# EAGLE design Automated_Blinds_Remote (EAGLE 7.6.0)
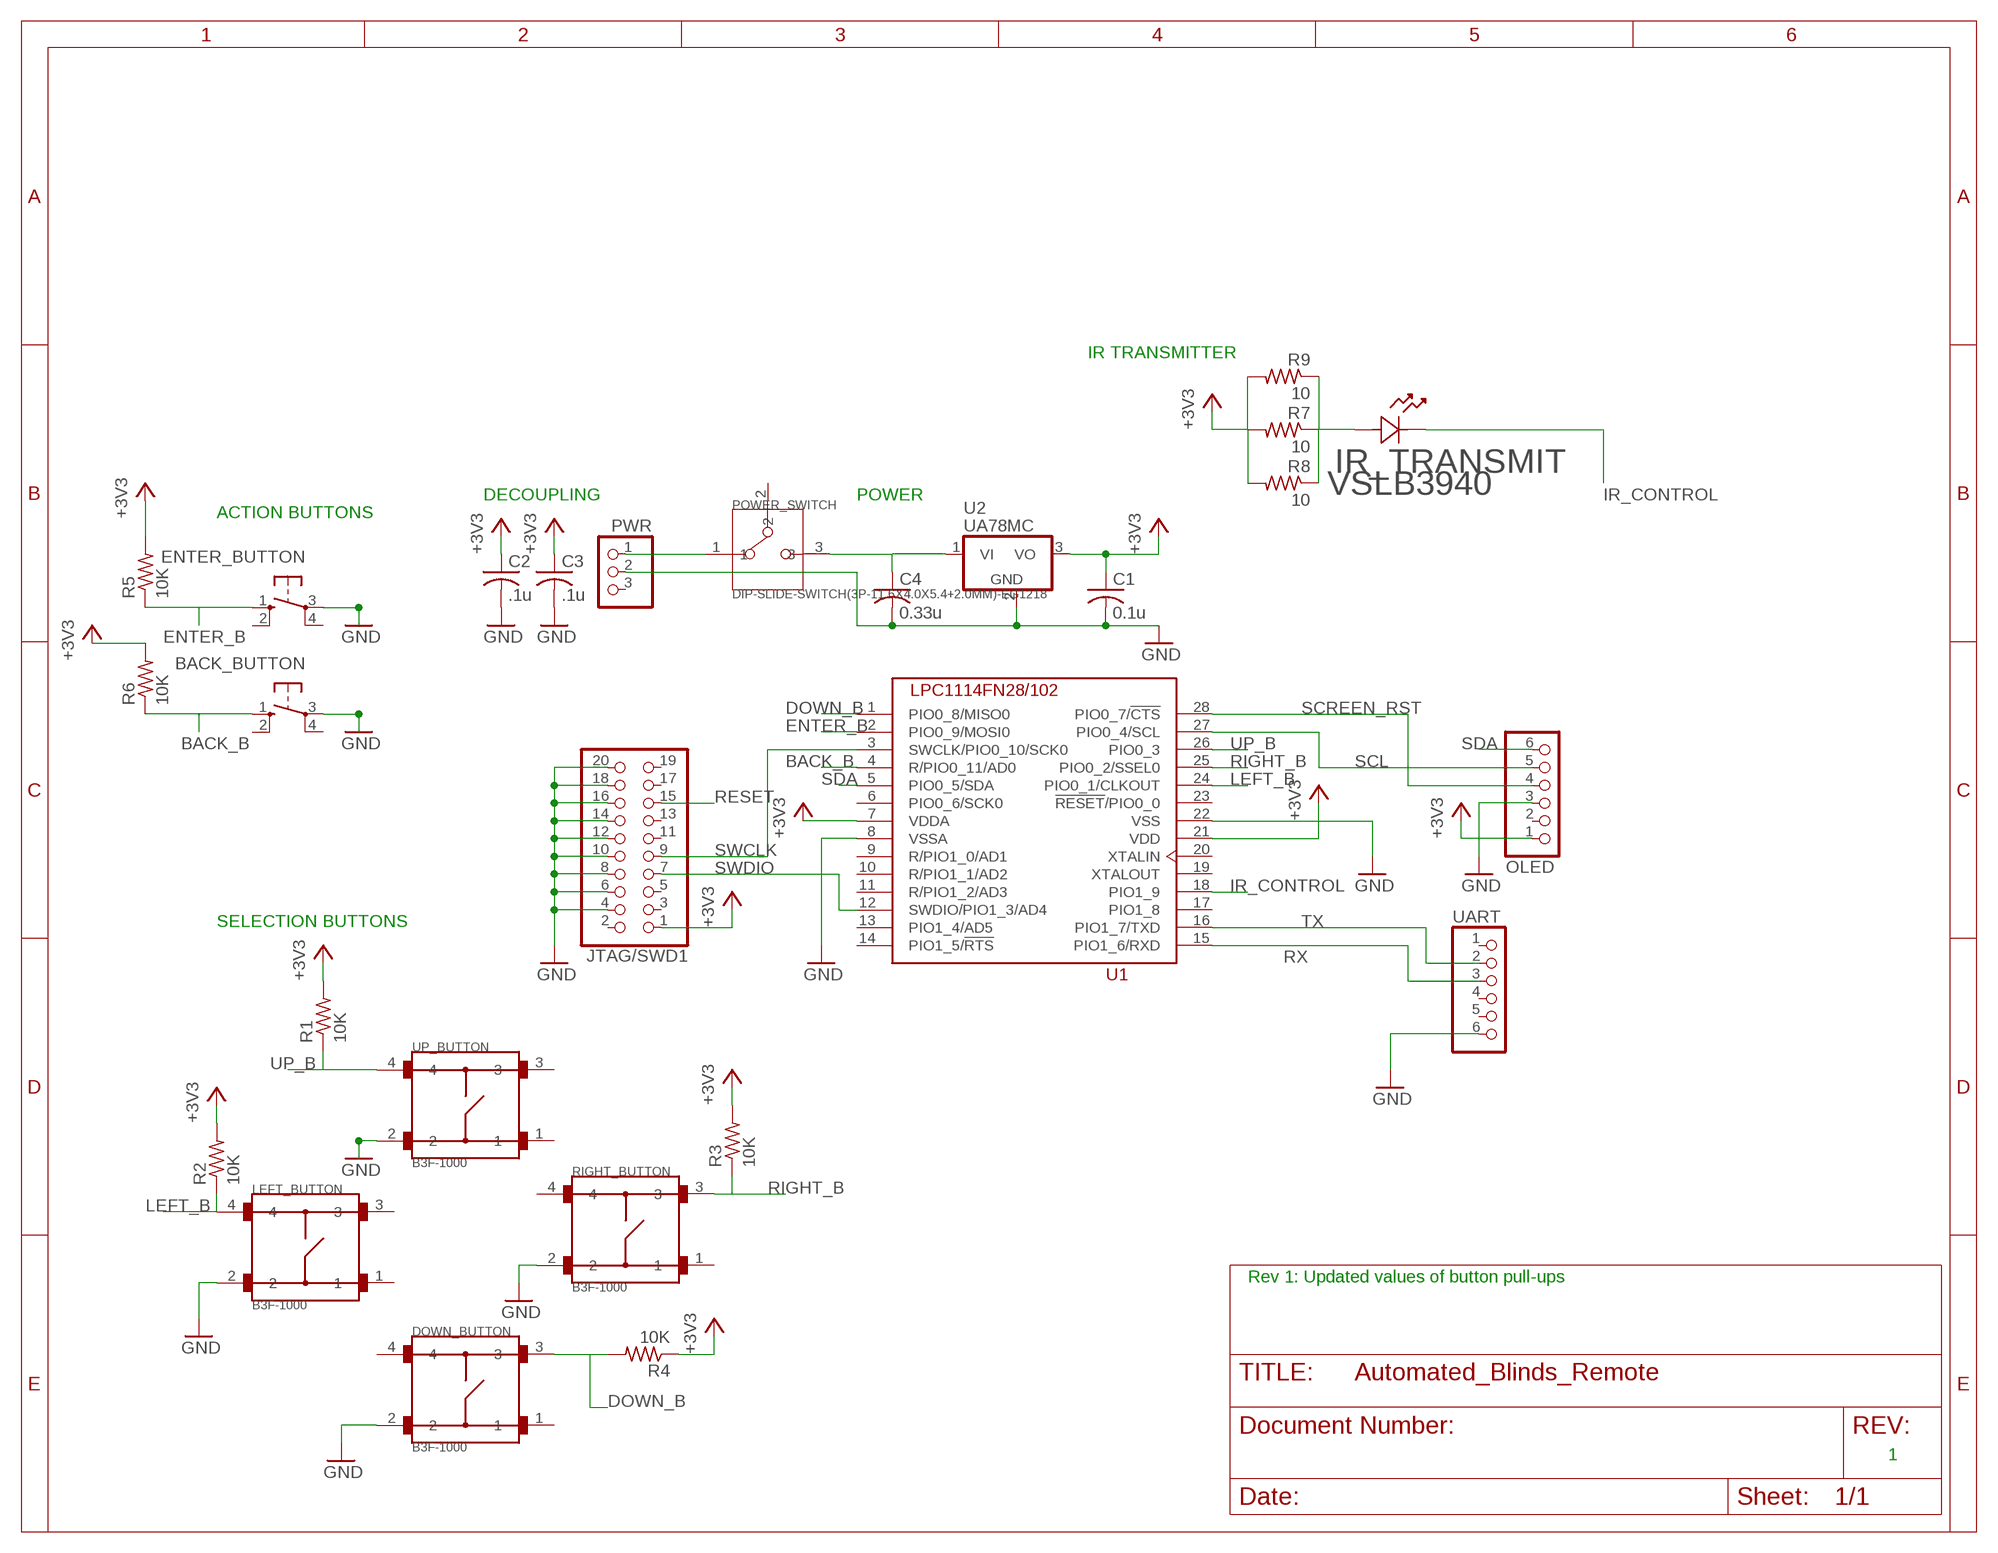
[diagram p0: schematic, sheet 1]

## Parts
BACK_BUTTON  40/XX  [B3F/40XX]
C1  0.1u  C-US050-024X044  [C050-024X044]
C2  .1u  C-US050-024X044  [C050-024X044]
C3  .1u  C-US050-024X044  [C050-024X044]
C4  0.33u  C-US050-024X044  [C050-024X044]
DOWN_BUTTON  B3F-1000  [SW_B3F-1000]
ENTER_BUTTON  40/XX  [B3F/40XX]
IR_TRANSMIT  VSLB3940  [LED_TLH]
JTAG/SWD1  PINHD-2X10  [2X10]
LEFT_BUTTON  B3F-1000  [SW_B3F-1000]
OLED  PINHD-1X6  [1X06]
POWER_SWITCH  DIP-SLIDE-SWITCH(3P-11.6X4.0X5.4+2.0MM)-EG1218  [SW3-2.5-11.6X4.0X5.4+2.0MM]
PWR  PINHD-1X3  [1X03]
R1  10K  R-US_0207/10  [0207/10]
R2  10K  R-US_0207/10  [0207/10]
R3  10K  R-US_0207/10  [0207/10]
R4  10K  R-US_0207/10  [0207/10]
R5  10K  R-US_0207/10  [0207/10]
R6  10K  R-US_0207/10  [0207/10]
R7  10  R-US_0207/10  [0207/10]
R8  10  R-US_0207/10  [0207/10]
R9  10  R-US_0207/10  [0207/10]
RIGHT_BUTTON  B3F-1000  [SW_B3F-1000]
U1  LPC1114FN28/102  [DIL28-6]
U2  UA78MC  [TO220V]
UART  PINHD-1X6  [1X06]
UP_BUTTON  B3F-1000  [SW_B3F-1000]

## Nets
+3V3: C1.1 C2.1 C3.1 JTAG/SWD1.1 OLED.1 R1.2 R2.2 R3.2 R4.1 R5.2 R6.2 R7.2 R8.2 R9.2 U1.7(VDDA) U1.21(VDD) U2.3(VO)
BACK_B: BACK_BUTTON.1(S) R6.1 U1.4(R/PIO0_11/AD0)
DOWN_B: DOWN_BUTTON.3 R4.2 U1.1(PIO0_8/MISO0)
ENTER_B: ENTER_BUTTON.1(S) R5.1 U1.2(PIO0_9/MOSI0)
GND: BACK_BUTTON.3(P) C1.2 C2.2 C3.2 C4.2 DOWN_BUTTON.2 ENTER_BUTTON.3(P) JTAG/SWD1.4 JTAG/SWD1.6 JTAG/SWD1.8 JTAG/SWD1.10 JTAG/SWD1.12 JTAG/SWD1.14 JTAG/SWD1.16 JTAG/SWD1.18 JTAG/SWD1.20 LEFT_BUTTON.2 OLED.3 PWR.2 RIGHT_BUTTON.2 U1.8(VSSA) U1.22(VSS) U2.2(GND) UART.6 UP_BUTTON.2
IR_CONTROL: IR_TRANSMIT.1 U1.18(PIO1_9)
LEFT_B: LEFT_BUTTON.4 R2.1 U1.24(PIO0_1/CLKOUT)
N$1: IR_TRANSMIT.2 R7.1 R8.1 R9.1
N$3: POWER_SWITCH.1 PWR.1
N$4: C4.1 POWER_SWITCH.3 U2.1(VI)
RESET: JTAG/SWD1.15
RIGHT_B: R3.1 RIGHT_BUTTON.3 U1.25(PIO0_2/SSEL0)
RX: U1.15(PIO1_6/RXD) UART.3
SCL: OLED.5 U1.27(PIO0_4/SCL)
SCREEN_RST: OLED.4 U1.28(PIO0_7/!CTS)
SDA: OLED.6 U1.5(PIO0_5/SDA)
SWCLK: JTAG/SWD1.9 U1.3(SWCLK/PIO0_10/SCK0)
SWDIO: JTAG/SWD1.7 U1.12(SWDIO/PIO1_3/AD4)
TX: U1.16(PIO1_7/TXD) UART.2
UP_B: R1.1 U1.26(PIO0_3) UP_BUTTON.4
Unconnected: BACK_BUTTON.2(S1) BACK_BUTTON.4(P1) DOWN_BUTTON.1 DOWN_BUTTON.4 ENTER_BUTTON.2(S1) ENTER_BUTTON.4(P1) JTAG/SWD1.2 JTAG/SWD1.3 JTAG/SWD1.5 JTAG/SWD1.11 JTAG/SWD1.13 JTAG/SWD1.17 JTAG/SWD1.19 LEFT_BUTTON.1 LEFT_BUTTON.3 OLED.2 POWER_SWITCH.2 PWR.3 RIGHT_BUTTON.1 RIGHT_BUTTON.4 U1.6(PIO0_6/SCK0) U1.9(R/PIO1_0/AD1) U1.10(R/PIO1_1/AD2) U1.11(R/PIO1_2/AD3) U1.13(PIO1_4/AD5) U1.14(PIO1_5/!RTS) U1.17(PIO1_8) U1.19(XTALOUT) U1.20(XTALIN) U1.23(!RESET!/PIO0_0) UART.1 UART.4 UART.5 UP_BUTTON.1 UP_BUTTON.3

## Notes on the sheet
- IR TRANSMITTER
- DECOUPLING | POWER
- ACTION BUTTONS
- SELECTION BUTTONS
- Rev 1: Updated values of button pull-ups
- 1

## Library data of the parts
BACK_BUTTON ENTER_BUTTON = switch-omron:40/XX: OMRON SWITCH; OC_FARNELL: unknown; OC_NEWARK: unknown
C1-C4 = rcl:C-US: CAPACITOR, American symbol
DOWN_BUTTON LEFT_BUTTON RIGHT_BUTTON UP_BUTTON = B3F-1000:B3F-1000: Switch, FLUX TIGHT MECHANICAL KEYSwitch, , 50MA@24VDC, NO GROUND TERM., FLAT PLUNG; AVAILABILITY: Good; DESCRIPTION: Switch, FLUX TIGHT MECHANICAL KEYSwitch, , 50MA@24VDC, NO GROUND TERM., FLAT PLUNG; MF: Omron; MP: B3F-1000; PACKAGE: None; PRICE: 0.21 USD
IR_TRANSMIT = VSLB3940:VSLB3940; MANUFACTURER_PART_NUMBER: VSLB3940; VENDOR: Vishay
JTAG/SWD1 = pinhead:PINHD-2X10: PIN HEADER
OLED UART = pinhead:PINHD-1X6: PIN HEADER
POWER_SWITCH = DIP-SLIDE-SWITCH_3P-11.6X4.0X5.4_2.0MM_:DIP-SLIDE-SWITCH(3P-11.6X4.0X5.4+2.0MM): 311010006; AVAILABILITY: Good; DESCRIPTION: EG Series SPDT On-On Vertical Through Hole Slide Switch; MF: E-Switch; MP: EG1218; PACKAGE: FakePackage u; PRICE: 0.41 USD
PWR = pinhead:PINHD-1X3: PIN HEADER
R1-R9 = rcl:R-US_: RESISTOR, American symbol
U1 = lpc_11xx:LPC1114FN28/102
U2 = lpc_11xx:UA78M*C

## Board
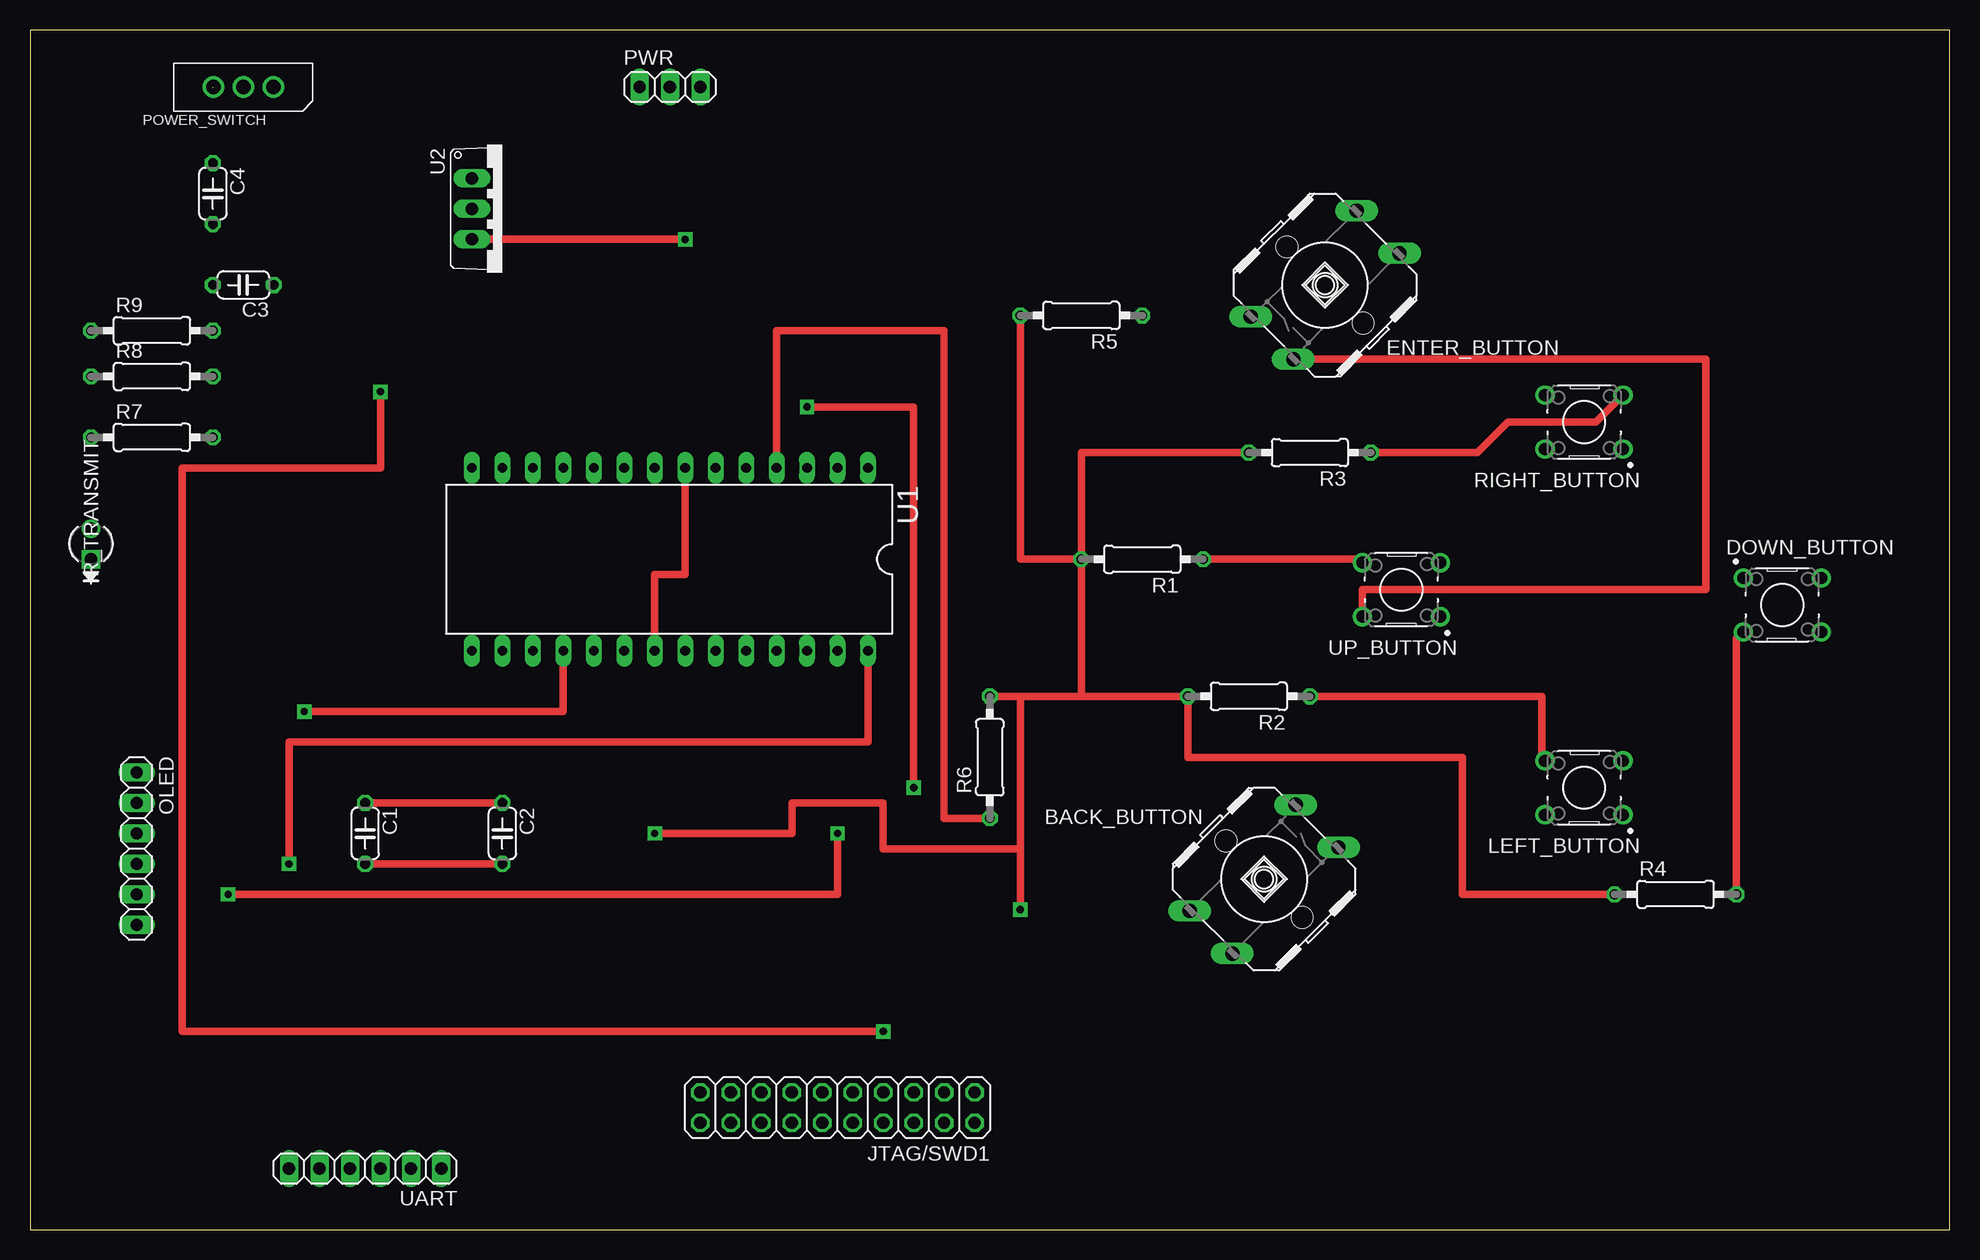
[diagram p1: board, top side]
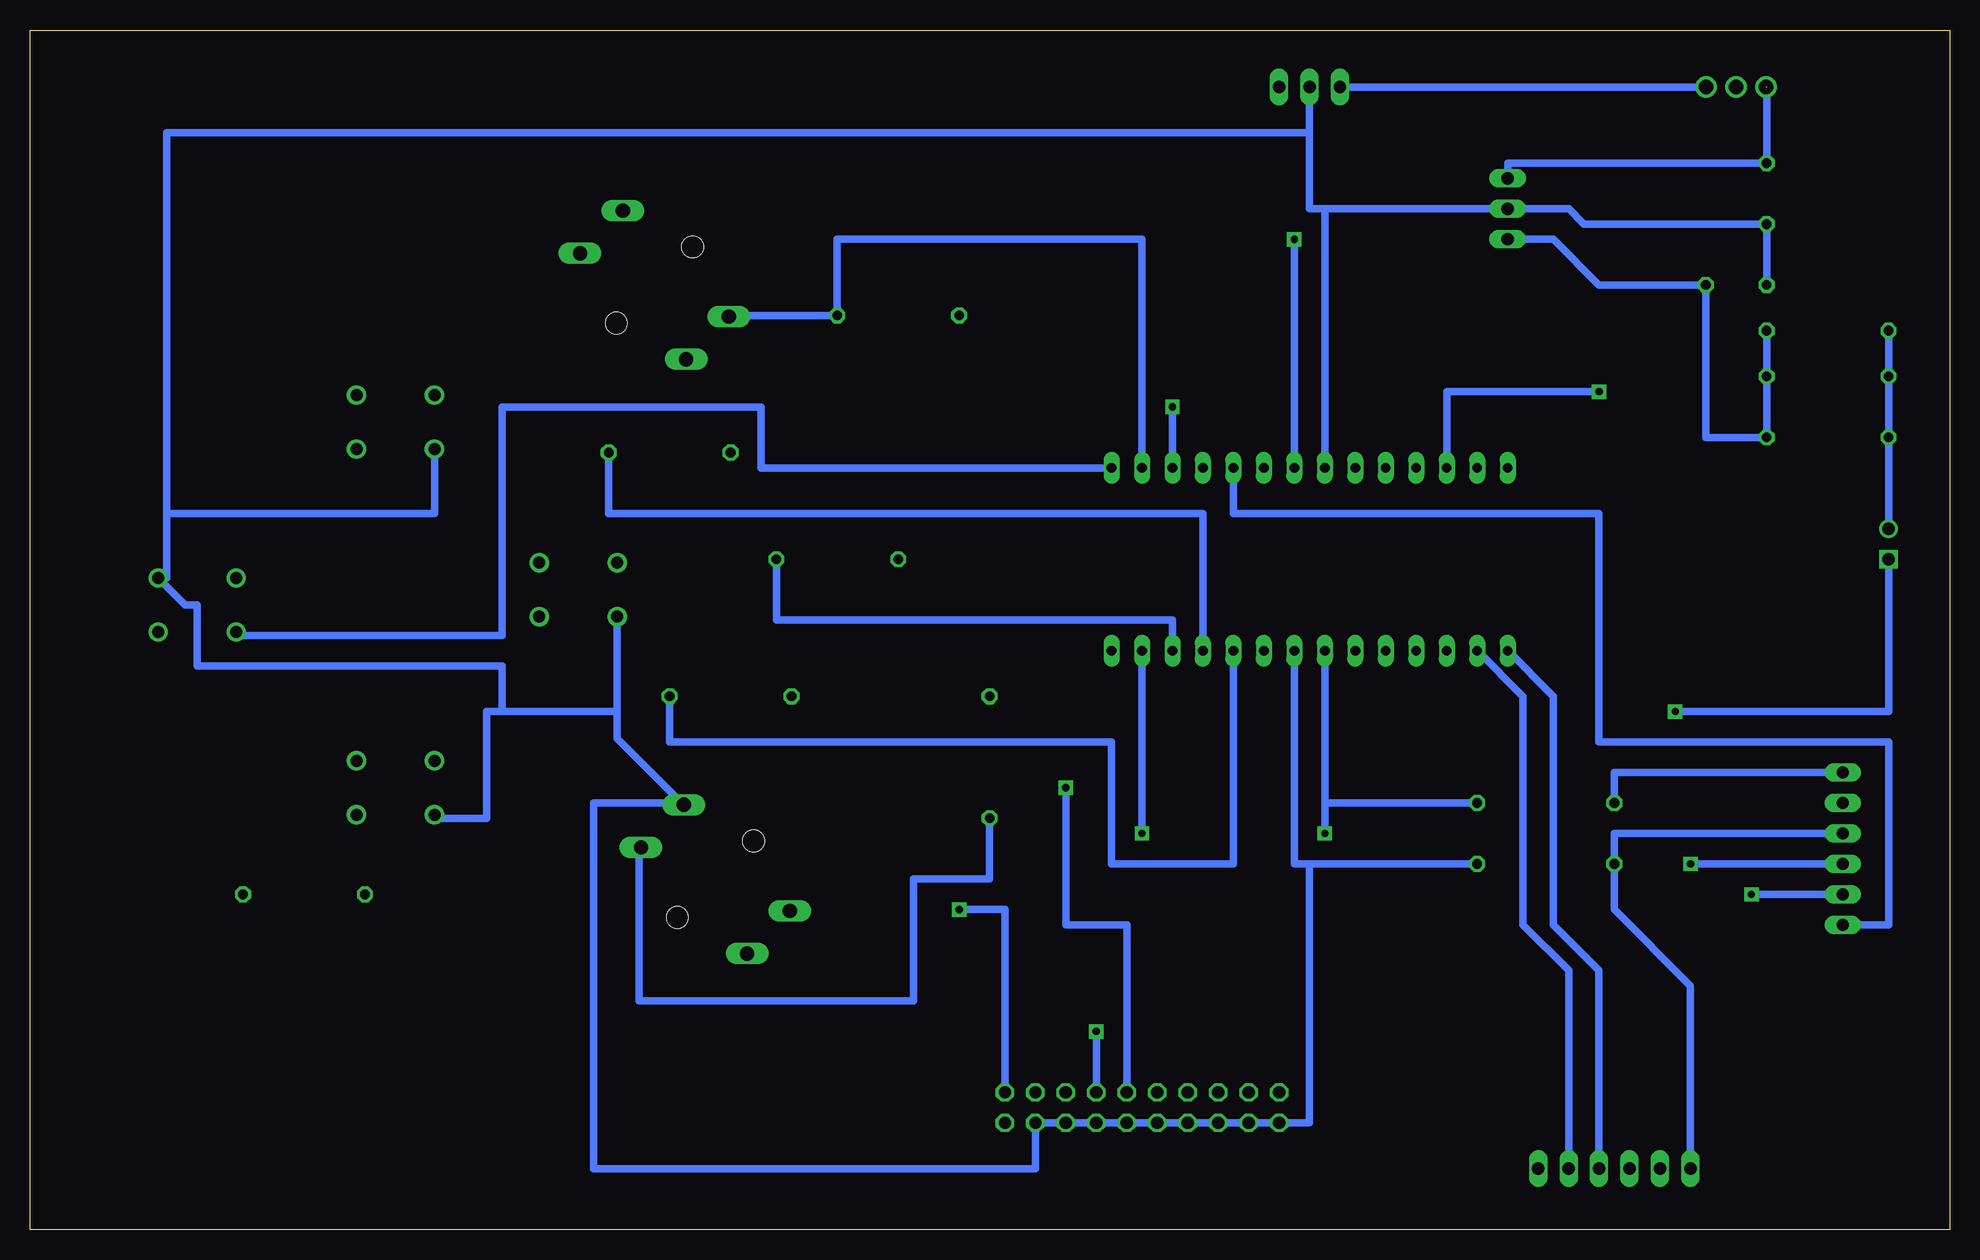
[diagram p2: board, bottom side, seen from below]

Size 160 x 100 mm. Coordinates in mm from the lower left corner, seen from the top.
Outline: 0,0 160,0 160,100 0,100 0,0
Copper layers (1*16): Top 0.035mm / dielectric 1.5mm / Bottom 0.035mm
Design rules "MWSEagleDesignRules3": minimum track width 13mil, minimum drill 22mil, track to track 8.5mil, track to pad 8.5mil, pad to pad 8.5mil, via to via 8.5mil, smd to smd 8mil, copper to edge 40mil, drill to drill 8mil, minimum pad ring 10mil, minimum via ring 8mil, stop-mask expansion 4mil, vias tented up to drill 0mil, thermal gap 10mil

### Footprints (pad centres in the part's own frame; a part is rotated, then mirrored left to right if it is on the bottom)
B3F/40XX = drill 1.194 long: 1 -6.198,-2.642; 2 2.642,6.198; 3 -2.642,-6.198; 4 6.198,2.642 | hole 1.803: -3.175,3.175; 3.175,-3.175
C050-024X044 = drill 0.813 octagon: 1 -2.54,0; 2 2.54,0
SW_B3F-1000 = drill 1 pad 1.6: 1 -3.25,2.25; 2 3.25,2.25; 3 -3.25,-2.25; 4 3.25,-2.25
LED_TLH = drill 1.016 pad 1.524 square: 1 -2.54,0 | drill 1.016 pad 1.524: 2 0,0
2X10 = drill 1.016 octagon: 1 -11.43,-1.27; 2 -11.43,1.27; 3 -8.89,-1.27; 4 -8.89,1.27; 5 -6.35,-1.27; 6 -6.35,1.27; 7 -3.81,-1.27; 8 -3.81,1.27; 9 -1.27,-1.27; 10 -1.27,1.27; 11 1.27,-1.27; 12 1.27,1.27; 13 3.81,-1.27; 14 3.81,1.27; 15 6.35,-1.27; 16 6.35,1.27; 17 8.89,-1.27; 18 8.89,1.27; 19 11.43,-1.27; 20 11.43,1.27
1X06 = drill 1.016 long: 1 -6.35,0; 2 -3.81,0; 3 -1.27,0; 4 1.27,0; 5 3.81,0; 6 6.35,0
SW3-2.5-11.6X4.0X5.4+2.0MM = drill 1.2: 1 -2.5,0; 2 0,0; 3 2.5,0
1X03 = drill 1.016 long: 1 -2.54,0; 2 0,0; 3 2.54,0
0207/10 = drill 0.813 octagon: 1 -5.08,0; 2 5.08,0
DIL28-6 = drill 0.813 long: 1 -16.51,-7.62; 2 -13.97,-7.62; 3 -11.43,-7.62; 4 -8.89,-7.62; 5 -6.35,-7.62; 6 -3.81,-7.62; 7 -1.27,-7.62; 8 1.27,-7.62; 9 3.81,-7.62; 10 6.35,-7.62; 11 8.89,-7.62; 12 11.43,-7.62; 13 13.97,-7.62; 14 16.51,-7.62; 15 16.51,7.62; 16 13.97,7.62; 17 11.43,7.62; 18 8.89,7.62; 19 6.35,7.62; 20 3.81,7.62; 21 1.27,7.62; 22 -1.27,7.62; 23 -3.81,7.62; 24 -6.35,7.62; 25 -8.89,7.62; 26 -11.43,7.62; 27 -13.97,7.62; 28 -16.51,7.62
TO220V = drill 1.016 long: 1 -2.54,-2.54; 2 0,-2.54; 3 2.54,-2.54

### Placement (x,y rotation side)
BACK_BUTTON  102.87,29.21 180 top
C1  27.94,33.02 270 top
C2  39.37,33.02 270 top
C3  17.78,78.74 180 top
C4  15.24,86.36 270 top
DOWN_BUTTON  146.05,52.07 0 top
ENTER_BUTTON  107.95,78.74 0 top
IR_TRANSMIT  5.08,58.42 90 top
JTAG/SWD1  67.31,10.16 180 top
LEFT_BUTTON  129.54,36.83 180 top
OLED  8.89,31.75 270 top
POWER_SWITCH  17.78,95.25 180 top
PWR  53.34,95.25 0 top
R1  92.71,55.88 180 top
R2  101.6,44.45 180 top
R3  106.68,64.77 180 top
R4  137.16,27.94 0 top
R5  87.63,76.2 180 top
R6  80.01,39.37 90 top
R7  10.16,66.04 0 top
R8  10.16,71.12 0 top
R9  10.16,74.93 0 top
RIGHT_BUTTON  129.54,67.31 180 top
U1  53.34,55.88 180 top
U2  39.37,85.09 270 top
UART  27.94,5.08 180 top
UP_BUTTON  114.3,53.34 180 top

### Tracks (layer width: path | path; a pad name or v marks a point on that pad's centre or on a via)
+3V3  (via drill 0.6)
  Top 0.61: C1.1 C2.1 | R6.2 82.55,44.45 | 82.55,44.45 87.63,44.45 | 87.63,44.45 R2.2 96.52,39.37 119.38,39.37 119.38,27.94 R4.1 | R1.2 87.63,44.45 | R5.2 82.55,55.88 R1.2 | U2.3 v54.61,82.55 | R1.2 87.63,64.77 R3.2 | v82.55,26.67 82.55,31.75 | 82.55,31.75 82.55,44.45 | v52.07,33.02 63.5,33.02 63.5,35.56 71.12,35.56 71.12,31.75 82.55,31.75 | U1.21 52.07,54.61 54.61,54.61 U1.7
  Bottom 0.61: OLED.1 27.94,38.1 C1.1 | v54.61,82.55 U1.7 | C2.1 52.07,35.56 | 52.07,35.56 U1.21 | R9.2 R8.2 R7.2 20.32,66.04 C3.1 29.21,78.74 33.02,82.55 U2.3 | JTAG/SWD1.1 78.74,26.67 v82.55,26.67 | 52.07,35.56 v52.07,33.02
BACK_B
  Top 0.61: R6.1 76.2,34.29 76.2,74.93 62.23,74.93 U1.4
  Bottom 0.61: 108.97,31.75 BACK_BUTTON.1 109.22,31.85 109.22,19.05 86.36,19.05 86.36,29.21 80.01,29.21 R6.1
DOWN_B
  Top 0.61: R4.2 142.24,49.26 DOWN_BUTTON.3
  Bottom 0.61: U1.1 99.06,63.5 99.06,68.58 120.65,68.58 120.65,49.53 142.51,49.53 DOWN_BUTTON.3
ENTER_B
  Bottom 0.61: ENTER_BUTTON.1 101.65,76.2 R5.1 92.71,82.55 67.31,82.55 U1.2
GND
  Top 0.61: C1.2 C2.2 | UP_BUTTON.2 111.05,53.34 139.7,53.34 139.7,72.54 ENTER_BUTTON.3
  Bottom 0.61: RIGHT_BUTTON.2 126.29,59.69 148.59,59.69 | 148.59,59.69 148.59,54.32 DOWN_BUTTON.2 147.05,52.07 146.05,52.07 146.05,46.99 120.65,46.99 120.65,43.18 | 52.07,85.09 U2.2 31.75,85.09 30.48,83.82 C4.2 C3.2 | 52.07,85.09 53.34,85.09 53.34,91.44 | 53.34,91.44 PWR.2 | U1.8 52.07,85.09 | C2.2 53.34,30.48 | 53.34,30.48 54.61,30.48 U1.22 | OLED.3 27.94,33.02 C1.2 27.94,26.67 21.59,20.32 UART.6 | UP_BUTTON.2 111.05,43.18 | 111.05,43.18 111.05,40.95 BACK_BUTTON.3 105.51,35.56 113.03,35.56 113.03,5.08 76.2,5.08 JTAG/SWD1.4 JTAG/SWD1.6 JTAG/SWD1.8 JTAG/SWD1.10 JTAG/SWD1.12 JTAG/SWD1.14 JTAG/SWD1.16 JTAG/SWD1.18 JTAG/SWD1.20 53.34,8.89 53.34,30.48 | 120.65,43.18 111.05,43.18 | 53.34,91.44 148.59,91.44 148.59,59.69 | LEFT_BUTTON.2 126.29,34.29 121.92,34.29 121.92,43.18 120.65,43.18
IR_CONTROL  (via drill 0.6)
  Top 0.61: v22.86,43.18 44.45,43.18 U1.18
  Bottom 0.61: IR_TRANSMIT.1 5.08,43.18 v22.86,43.18
LEFT_B
  Top 0.61: R2.1 126,44.45 126,39.08 LEFT_BUTTON.4
  Bottom 0.61: R2.1 106.68,40.64 69.85,40.64 69.85,30.48 59.69,30.48 U1.24
N$1
  Bottom 0.61: IR_TRANSMIT.2 R7.1 R8.1 R9.1
N$3
  Bottom 0.61: POWER_SWITCH.1 PWR.1
N$4  (1 unrouted)
  Bottom 0.61: 15.24,95.25 C4.1 36.83,88.9 U2.1
RIGHT_B
  Top 0.61: R3.1 120.65,64.77 123.19,67.31 130.54,67.31 RIGHT_BUTTON.3
  Bottom 0.61: U1.25 62.23,59.69 111.76,59.69 R3.1
RX
  Bottom 0.61: UART.3 29.21,21.59 33.02,25.4 33.02,44.45 U1.15
SCL  (via drill 0.6)
  Top 0.61: v16.51,27.94 67.31,27.94 v67.31,33.02
  Bottom 0.61: v16.51,27.94 OLED.5 | v67.31,33.02 U1.27
SCREEN_RST  (via drill 0.6)
  Top 0.61: v21.59,30.48 21.59,40.64 69.85,40.64 U1.28
  Bottom 0.61: OLED.4 v21.59,30.48
SDA
  Bottom 0.61: OLED.6 5.08,25.4 5.08,40.64 29.21,40.64 29.21,59.69 59.69,59.69 U1.5
SWCLK  (via drill 0.6)
  Top 0.61: v73.66,36.83 73.66,68.58 v64.77,68.58
  Bottom 0.61: JTAG/SWD1.9 68.58,25.4 73.66,25.4 v73.66,36.83 | v64.77,68.58 U1.3
SWDIO  (via drill 0.6)
  Top 0.61: v71.12,16.51 12.7,16.51 12.7,63.5 29.21,63.5 v29.21,69.85
  Bottom 0.61: JTAG/SWD1.7 v71.12,16.51 | v29.21,69.85 41.91,69.85 U1.12
TX
  Bottom 0.61: UART.2 31.75,21.59 35.56,25.4 35.56,44.45 U1.16
UP_B
  Top 0.61: R1.1 110.76,55.88 UP_BUTTON.4
  Bottom 0.61: U1.26 64.77,50.8 97.79,50.8 R1.1